# Altium project PCB_Project1.PrjPCB
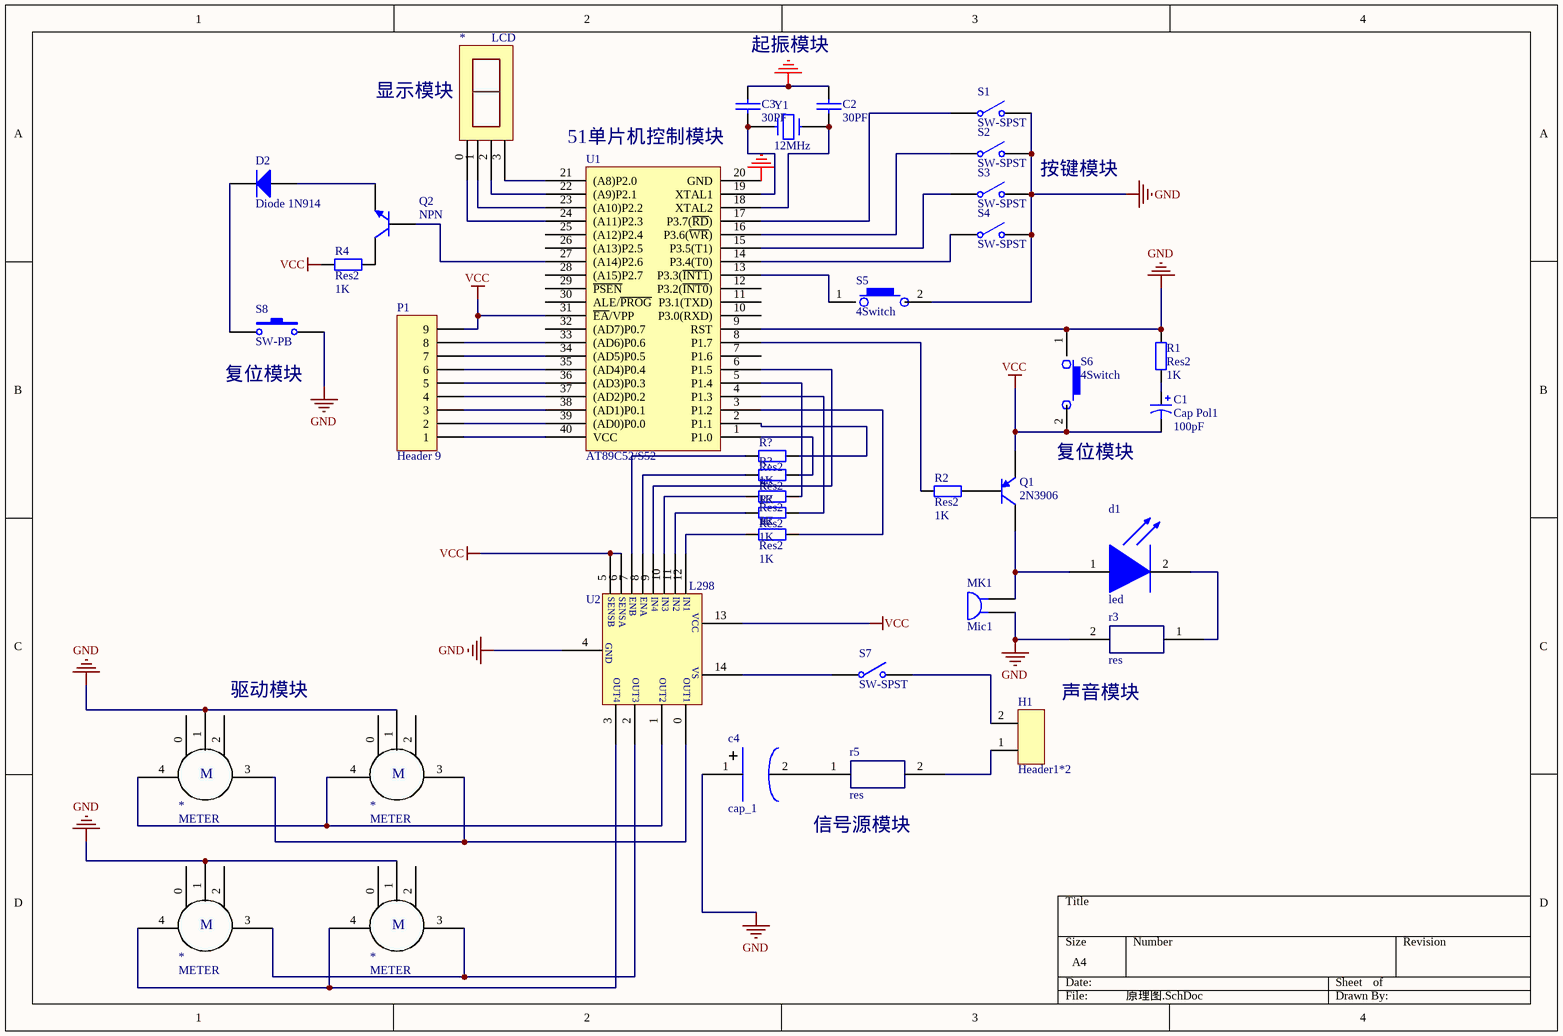
[diagram p0: 原理图.SchDoc]
1 sheet, 37 parts. Net scope: global (net labels, ports and power ports of the same name join across sheets).

## Sheet 原理图.SchDoc
size A4

### Parts
(Parts that share a designator on the sheet are numbered #1, #2 ... from top to bottom, then left to right.)
*#1  LCD
*#2  METER
*#3  METER
*#4  METER
*#5  METER
C1  Cap Pol1  value 100pF  [RB7.6-15]
C2  30PF  [RAD0.1]
C3  30PF  [RAD0.1]
c4  cap_1  [cap]
d1  led  [led]
D2  Diode 1N914  [DO-35]
H1  Header1*2  [Header1*2]
MK1  Mic1  [PIN2]
P1  Header 9  [HDR1X9]
Q1  2N3906  [TO-92A]
Q2  NPN  [TO-226]
R1  Res2  value 1K  [AXIAL-0.4]
R2  Res2  value 1K  [AXIAL-0.4]
r3  res  [res]
R4  Res2  value 1K  [AXIAL-0.4]
r5  res  [res]
R?#1  Res2  value 1K  [AXIAL-0.4]
R?#2  Res2  value 1K  [AXIAL-0.4]
R?#3  Res2  value 1K  [AXIAL-0.4]
R?#4  Res2  value 1K  [AXIAL-0.4]
R?#5  Res2  value 1K  [AXIAL-0.4]
S1  SW-SPST  [SPST-2]
S2  SW-SPST  [SPST-2]
S3  SW-SPST  [SPST-2]
S4  SW-SPST  [SPST-2]
S5  4Switch  [4Switch]
S6  4Switch  [4Switch]
S7  SW-SPST  [SPST-2]
S8  SW-PB  [SPST-2]
U1  AT89C52/S52  [STC89C51]
U2  L298
Y1  12MHz  [XTAL]

### Nets
GND: *#2.1 *#3.1 *#4.1 *#5.1 C2.2 C3.2 c4.1 MK1.1 R1.2 r3.2 S1.2(NO) S2.2(NO) S3.2(NO) S4.2(NO) S5.2 S6.1 S8.2 U1.9(RST) U1.20(GND) U2.4
VCC: C1.2 P1.9 Q1.1(E) R4.1 S6.2 U1.31(~{EA}/VPP) U2.5 U2.6 U2.13
Net*#1_0: *#1.0 U1.24((A11)P2.3)
Net*#1_1: *#1.1 U1.23((A10)P2.2)
Net*#1_2: *#1.2 U1.22((A9)P2.1)
Net*#1_3: *#1.3 U1.21((A8)P2.0)
Net*#2_3: *#2.3 *#3.3 U2.0
Net*#2_4: *#2.4 *#3.4 U2.1
Net*#4_3: *#4.3 *#5.3 U2.2
Net*#4_4: *#4.4 *#5.4 U2.3
NetC1_1: C1.1 R1.1
NetC2_1: C2.1 U1.18(XTAL2) Y1.1
NetC3_1: C3.1 U1.19(XTAL1) Y1.2
Netc4_2: c4.2 r5.1
Netd1_1: d1.1 MK1.2 Q1.3(C)
Netd1_2: d1.2 r3.1
NetD2_1: D2.1(A) Q2.3(E)
NetD2_2: D2.2(K) S8.1
NetH1_1: H1.1 r5.2
NetH1_2: H1.2 S7.2(NO)
NetP1_1: P1.1 U1.40(VCC)
NetP1_2: P1.2 U1.39((AD0)P0.0)
NetP1_3: P1.3 U1.38((AD1)P0.1)
NetP1_4: P1.4 U1.37((AD2)P0.2)
NetP1_5: P1.5 U1.36((AD3)P0.3)
NetP1_6: P1.6 U1.35((AD4)P0.4)
NetP1_7: P1.7 U1.34((AD5)P0.5)
NetP1_8: P1.8 U1.33((AD6)P0.6)
NetQ1_2: Q1.2(B) R2.2
NetQ2_1: Q2.1(C) R4.2
NetQ2_2: Q2.2(B) U1.27((A14)P2.6)
NetR2_1: R2.1 U1.8(P1.7)
NetR?#1_1: R?#1.1 U2.7
NetR?#1_2: R?#1.2 U1.2(P1.1)
NetR?#2_1: R?#2.1 U2.8
NetR?#2_2: R?#2.2 U1.1(P1.0)
NetR?#3_1: R?#3.1 U2.10
NetR?#3_2: R?#3.2 U1.5(P1.4)
NetR?#4_1: R?#4.1 U2.11
NetR?#4_2: R?#4.2 U1.4(P1.3)
NetR?#5_1: R?#5.1 U2.12
NetR?#5_2: R?#5.2 U1.3(P1.2)
NetS1_1: S1.1(COMMON) U1.17(P3.7(~{RD}))
NetS2_1: S2.1(COMMON) U1.16(P3.6(~{WR}))
NetS3_1: S3.1(COMMON) U1.15(P3.5(T1))
NetS4_1: S4.1(COMMON) U1.14(P3.4(T0))
NetS5_1: S5.1 U1.13(P3.3(~{INT1}))
NetS7_1: S7.1(COMMON) U2.14
NetU1_6: U1.6(P1.5) U2.9

Not connected (* = marked no-connect by the designer): *#2 0 2; *#3 0 2; *#4 0 2; *#5 0 2; U1 7(P1.6) 10(P3.0(RXD)) 11(P3.1(TXD)) 12(P3.2(~{INT0})) 25((A12)P2.4) 26((A13)P2.5) 28((A15)P2.7) 29(~{PSEN}) 30(ALE/~{PROG}) 32((AD7)P0.7)

### Notes on the sheet
- 显示模块
- 起振模块
- (near U1) 51单片机控制模块
- 按键模块
- (near S8) 复位模块
- 复位模块
- (near *#2) 驱动模块
- 声音模块
- 信号源模块
- (in symbol L298) SENSB; SENSA; ENB; ENA; IN4; IN3; IN2; IN1; VCC; GND; VS; OUT4; OUT3; OUT2; OUT1
- (in symbol METER) M

### Library data of the parts
C1 = Cap Pol1: Polarized Capacitor (Radial); Published: 8-Jun-2000; LatestRevisionDate: 17-Jul-2002; LatestRevisionNote: Re-released for DXP Platform.; PackageReference: RB7.6-15; Publisher: Altium Limited
C2 C3 = CAP: Capacitor
D2 = Diode 1N914: High Conductance Fast Diode; Published: 8-Jun-2000; LatestRevisionDate: 17-Jul-2002; LatestRevisionNote: Re-released for DXP Platform.; DatasheetDocument: 1997; PackageReference: DO-35; Publisher: Altium Limited; Code_JEDEC: DO-204-AH; ComponentLink1Description: Manufacturer Link; ComponentLink1URL: http://www.fairchildsemi.com/; ComponentLink2Description: Datasheet; ComponentLink2URL: http://www.fairchildsemi.com/ds/1N%2F1N4448.pdf
MK1 = Mic1: Microphone; Published: 24-Mar-1999; LatestRevisionDate: 17-Jul-2002; LatestRevisionNote: Re-released for DXP Platform.; PackageReference: PIN2; Publisher: Altium Limited
P1 = Header 9: Header, 9-Pin; LatestRevisionDate: 17-Jul-2002; LatestRevisionNote: Re-released for DXP Platform.; Publisher: Altium Limited
Q1 = 2N3906: PNP General Purpose Amplifier; Published: 8-Jun-2000; LatestRevisionDate: 15-Jan-2003; LatestRevisionNote: PCB Footprint 'BCY-W3/D4.7' replaced; DatasheetDocument: 1997; PackageDocument: Sep-1998; PackageReference: TO-92A; Publisher: Altium Limited; Code_JEDEC: TO-92A; ComponentLink1Description: Manufacturer Link; ComponentLink1URL: http://www.fairchildsemi.com/; ComponentLink2Description: Datasheet; ComponentLink2URL: http://www.fairchildsemi.com/ds/2N%2F2N3906.pdf
Q2 = NPN: NPN Bipolar Transistor; Published: 8-Jun-2000; LatestRevisionDate: 17-Jul-2002; LatestRevisionNote: Re-released for DXP Platform.; PackageReference: TO-226; Publisher: Altium Limited; Code_JEDEC: TO-226-AA
R1 R2 R4 R?#1-R?#5 = Res2: Resistor; Published: 8-Jun-2000; LatestRevisionDate: 17-Jul-2002; LatestRevisionNote: Re-released for DXP Platform.; PackageReference: AXIAL-0.4; Publisher: Altium Limited
S1-S4 S7 = SW-SPST: Single-Pole, Single-Throw Switch; Published: 24-Mar-1999; LatestRevisionDate: 17-Jul-2002; LatestRevisionNote: Re-released for DXP Platform.; PackageReference: SPST-2; Publisher: Altium Limited
S8 = SW-PB: Switch; Published: 24-Mar-1999; LatestRevisionDate: 17-Jul-2002; LatestRevisionNote: Re-released for DXP Platform.; PackageReference: SPST-2; Publisher: Altium Limited
U1 = AT89C51
Y1 = CRYSTAL